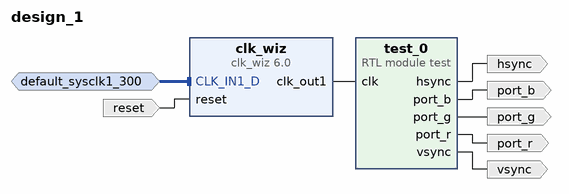
[diagram p0: block diagram of the top level]
# Vivado block design design_1, xcku5p-ffvb676-2-e, Vivado 2018.1
create_bd_design design_1

create_bd_intf_port -mode Slave -vlnv xilinx.com:interface:diff_clock_rtl:1.0 default_sysclk1_300
set_property -dict {CONFIG.FREQ_HZ 300000000} [get_bd_intf_ports default_sysclk1_300]
create_bd_port -dir I -type rst reset
set_property -dict {CONFIG.POLARITY ACTIVE_HIGH} [get_bd_ports reset]
create_bd_port -dir O -type data vsync
create_bd_port -dir O -type data hsync
create_bd_port -dir O -type data port_r
create_bd_port -dir O -type data port_g
create_bd_port -dir O -type data port_b

create_bd_cell -type ip -vlnv xilinx.com:ip:clk_wiz:6.0 clk_wiz
set_property -dict [list \
  CONFIG.CLKIN1_JITTER_PS 33.330000000000005 \
  CONFIG.CLKOUT1_REQUESTED_OUT_FREQ 25.125 \
  CONFIG.PRIM_SOURCE Differential_clock_capable_pin \
  CONFIG.USE_LOCKED false \
  CONFIG.MMCM_DIVCLK_DIVIDE 25 \
  CONFIG.MMCM_CLKFBOUT_MULT_F 100.500 \
  CONFIG.MMCM_CLKIN1_PERIOD 3.333 \
  CONFIG.MMCM_CLKIN2_PERIOD 10.0 \
  CONFIG.MMCM_CLKOUT0_DIVIDE_F 48.000 \
  CONFIG.USE_BOARD_FLOW true \
  CONFIG.CLK_IN1_BOARD_INTERFACE default_sysclk1_300 \
  CONFIG.RESET_BOARD_INTERFACE reset \
  CONFIG.CLKOUT1_JITTER 251.684 \
  CONFIG.CLKOUT1_PHASE_ERROR 350.468 \
] [get_bd_cells clk_wiz]
create_bd_cell -type module -reference test test_0

# ---- connections ----

connect_bd_intf_net -intf_net default_sysclk1_300_1 [get_bd_intf_ports default_sysclk1_300] [get_bd_intf_pins clk_wiz/CLK_IN1_D]
connect_bd_net [get_bd_pins clk_wiz/clk_out1] [get_bd_pins test_0/clk]
connect_bd_net [get_bd_ports reset] [get_bd_pins clk_wiz/reset]
connect_bd_net [get_bd_pins test_0/vsync] [get_bd_ports vsync]
connect_bd_net [get_bd_pins test_0/hsync] [get_bd_ports hsync]
connect_bd_net [get_bd_pins test_0/port_r] [get_bd_ports port_r]
connect_bd_net [get_bd_pins test_0/port_g] [get_bd_ports port_g]
connect_bd_net [get_bd_pins test_0/port_b] [get_bd_ports port_b]

validate_bd_design
save_bd_design
